# EAGLE design ERA_USB_PWR (EAGLE 6.6.0)
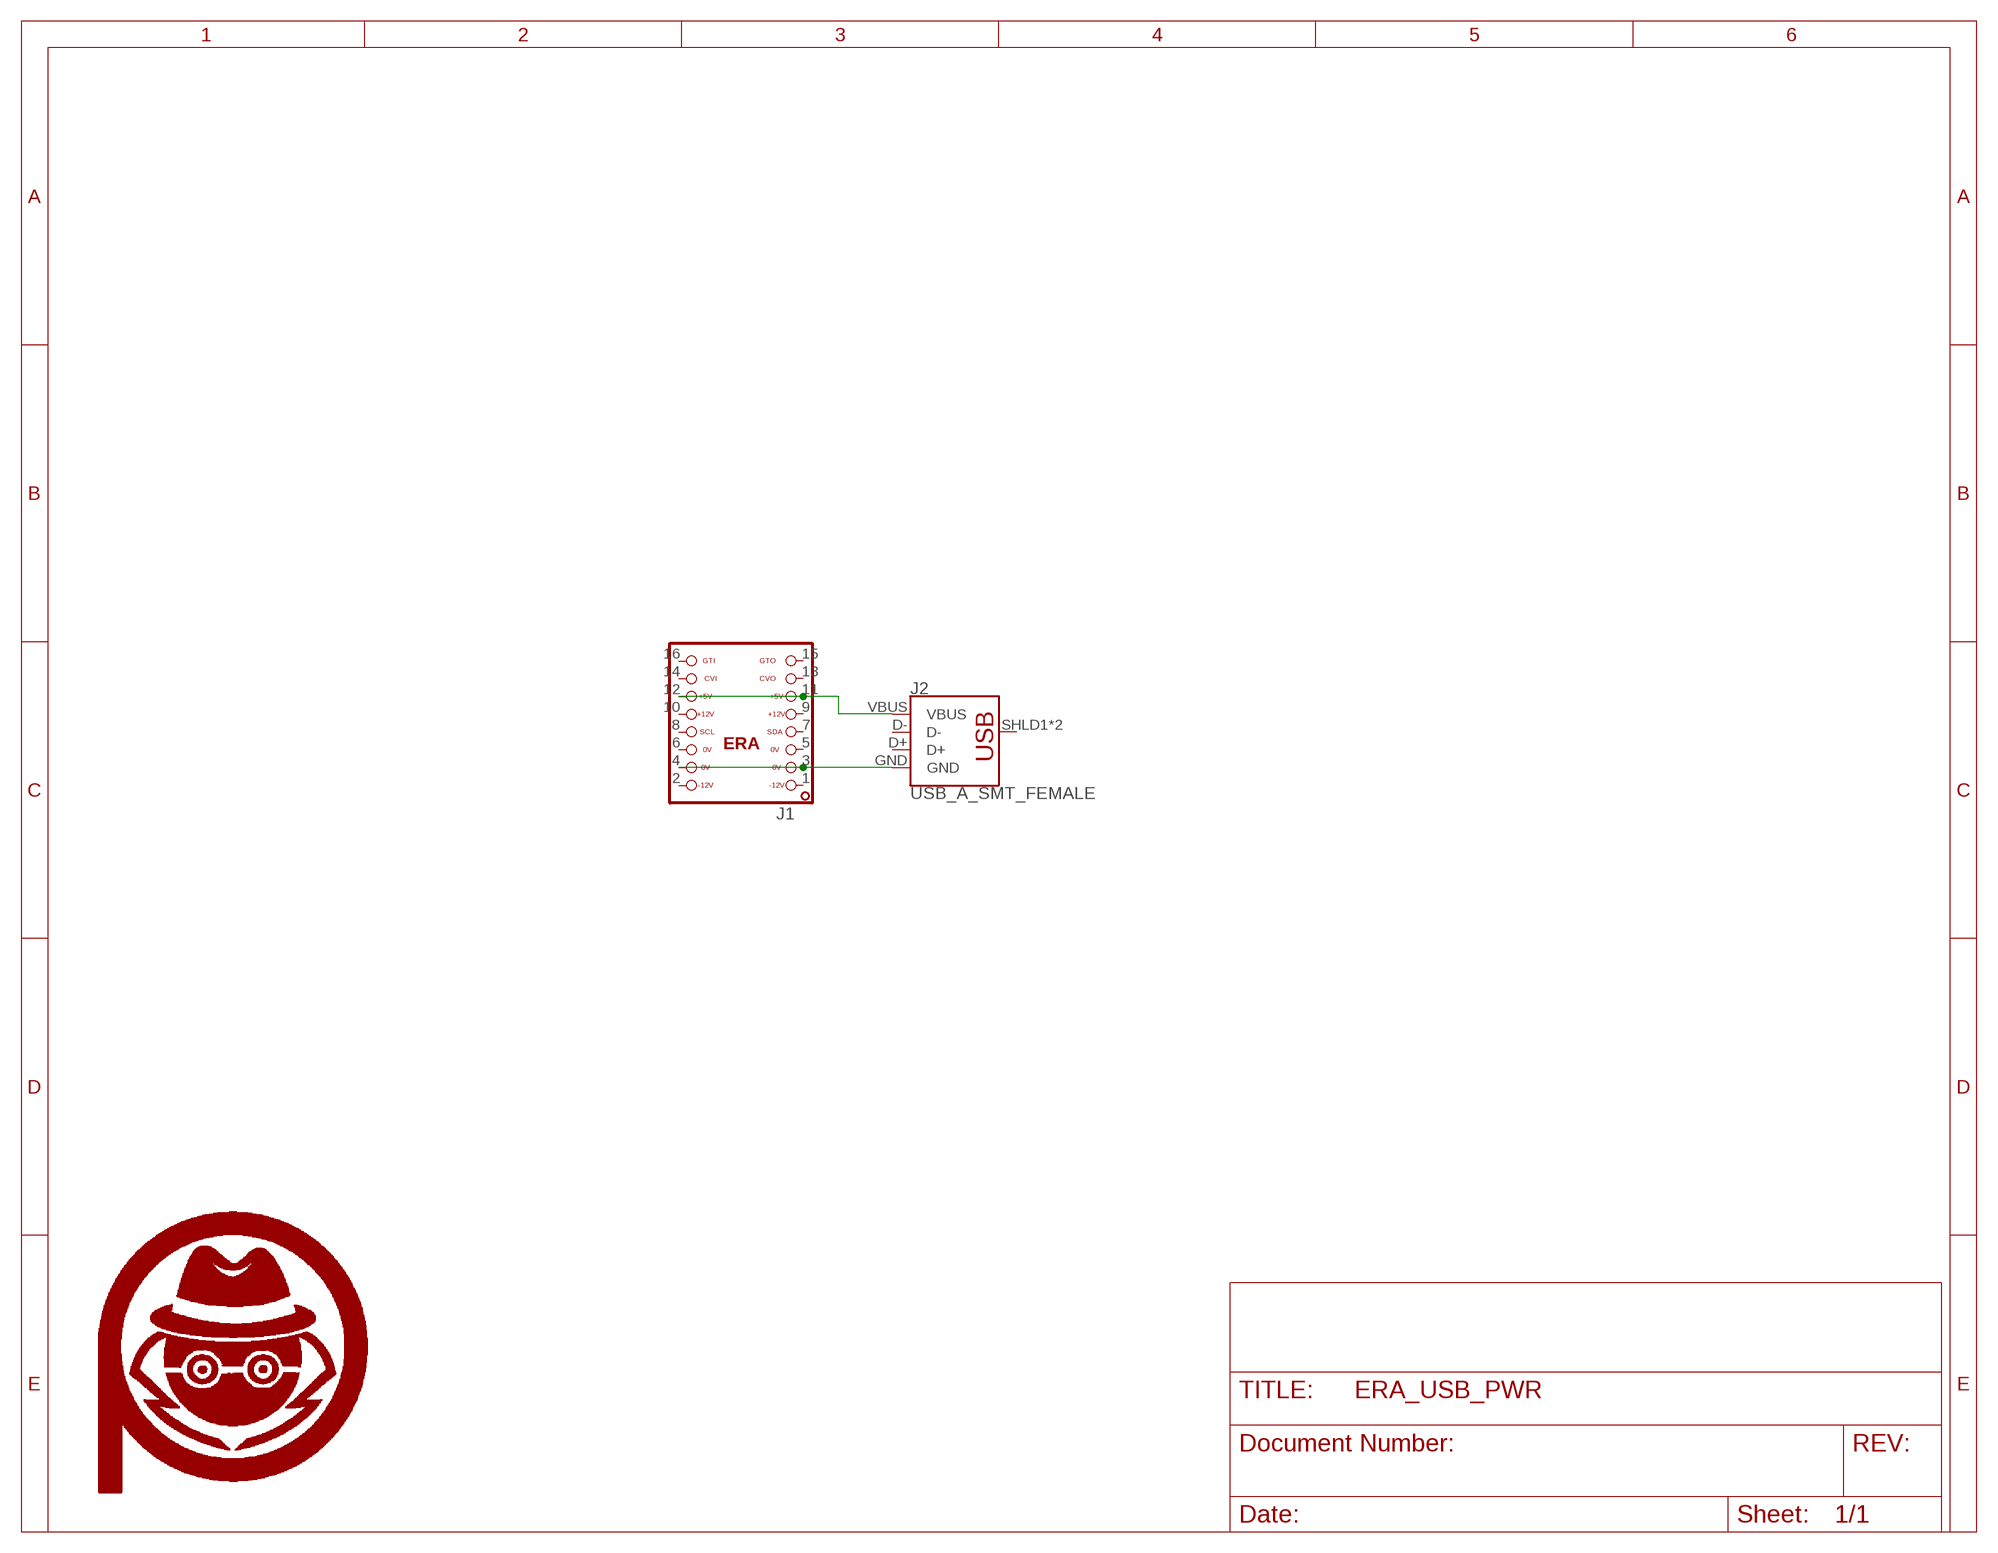
[diagram p0: schematic, sheet 1]

## Parts
J1  ERA_16PIN-NOSILK  [ERA-16-NOSILK]
J2  USB_A_SMT_FEMALE  [USB-A-S-SILK-FEMALE]
U$1  PA_LOGO_SYMSMALL  [PA_LOGO_AGENT_SMALL_SYM]
U$2  PA_LOGO_SYMSMALL  [PA_LOGO_AGENT_SMALL_SYM]

## Nets
GND: J1.3 J1.4 J2.GND
N$2: J1.11 J1.12 J2.VBUS
Unconnected: J1.1 J1.2 J1.5 J1.6 J1.7 J1.8 J1.9 J1.10 J1.13 J1.14 J1.15 J1.16 J2.D+ J2.D- J2.SHLD1(SHIELD) J2.SHLD2(SHIELD)

## Library data of the parts
J1 = ERA:ERA_16PIN: EuroRack2 - Backplane Connector
J2 = SparkFun-Connectors:USB_A: USB-A Connector Male and female variants, as well as PTH and SMT variants SparkFun Products: SparkFun XBee Explorer Dongle <https://www.sparkfun.com/products/11697> PTH Male SparkFun MicroView-USB Programmer <https://www.sparkfun.com/products/12924> SMT Male SparkFun USB Type A Female Breakout <https://www.sparkfun.com/products/12700> SMT Female; PROD_ID: CONN-09520; SF_ID: PRT-09011
U$1 U$2 = PatternAgents-Logos:PA_LOGO_SYM: PatternAgents Logo Symbol Trademark : PatternAgents, LLC Github : https://github.com/PatternAgents/PCB_Libraries License : http://creativecommons.org/licenses/by-sa/3.0/ (Creative Commons 3.0) THIS SOFTWARE IS PROVIDED BY THE CONTRIBUTORS "AS IS" AND WITHOUT ANY EXPRESS OR IMPLIED WARRANTIES, INCLUDING, BUT NOT LIMITED TO, THE IMPLIED WARRANTIES OF MERCHANTABILITY AND FITNESS FOR A PARTICULAR PURPOSE ARE DISCLAIMED. IN NO EVENT SHALL THE COPYRIGHT OWNER OR CONTRIBUTORS BE LIABLE FOR ANY DIRECT, INDIRECT, INCIDENTAL, SPECIAL, EXEMPLARY, OR CONSEQUENTIAL DAMAGES (INCLUDING, BUT NOT LIMITED TO, PROCUREMENT OF SUBSTITUTE GOODS OR SERVICES; LOSS OF USE, DATA, OR PROFITS; OR BUSINESS INTERRUPTION) HOWEVER CAUSED AND ON ANY THEORY OF LIABILITY, WHETHER IN CONTRACT, STRICT LIABILITY, OR TORT (INCLUDING NEGLIGENCE OR OTHERWISE) ARISING IN ANY WAY OUT OF THE USE OF THIS SOFTWARE, EVEN IF ADVISED OF THE POSSIBILITY OF SUCH DAMAGE.

## Board
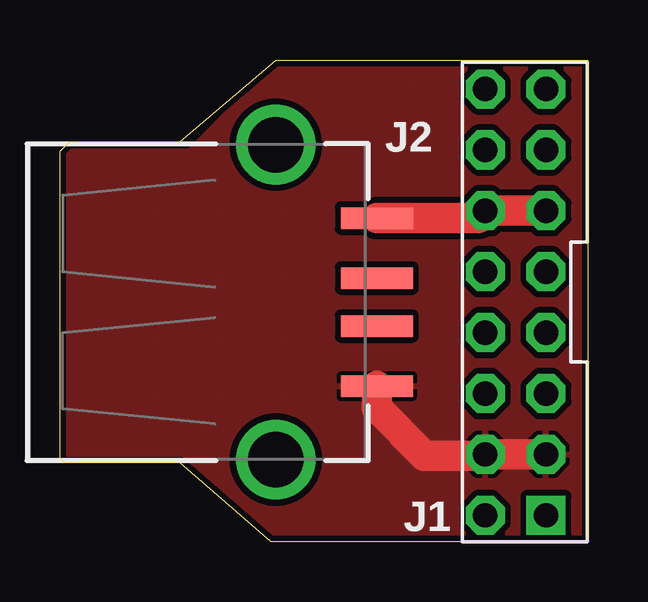
[diagram p1: board, top side]
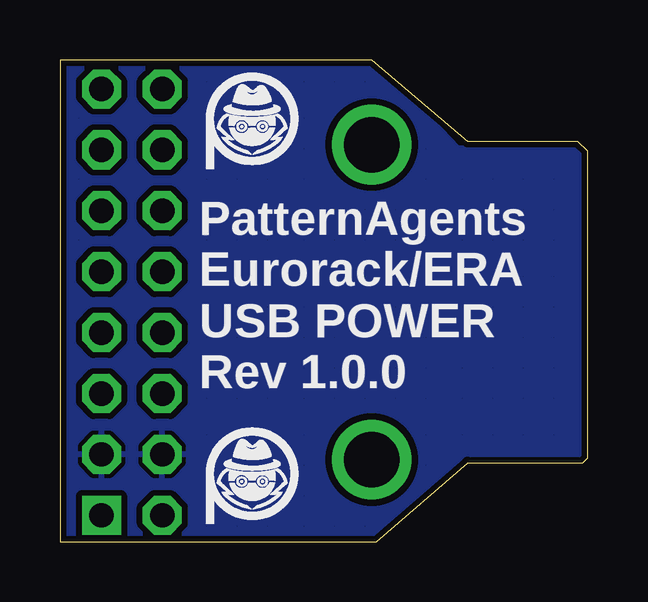
[diagram p2: board, bottom side, seen from below]

Size 22 x 20.1 mm. Coordinates in mm from the lower left corner, seen from the top.
Outline: 22,20.1 22,0 8.8,0 5,3.3 0.2,3.3 0,3.5 0,16.3 0.4,16.7 5,16.7 9,20.1 22,20.1
Copper layers (1*16): Top 0.035mm / dielectric 1.5mm / Bottom 0.035mm
Design rules "PatternAgents_7mil": minimum track width 7mil, minimum drill 14mil, track to track 7mil, track to pad 7mil, pad to pad 7mil, via to via 7mil, smd to smd 7mil, copper to edge 7mil, drill to drill 7mil, minimum pad ring 12mil, minimum via ring 10mil, stop-mask expansion 4mil, vias tented up to drill 25mil, thermal gap 7mil

### Footprints (pad centres in the part's own frame; a part is rotated, then mirrored left to right if it is on the bottom)
ERA-16-NOSILK = drill 1.016 square: 1 -8.89,-1.27 | drill 1.016 octagon: 2 -8.89,1.27; 3 -6.35,-1.27; 4 -6.35,1.27; 5 -3.81,-1.27; 6 -3.81,1.27; 7 -1.27,-1.27; 8 -1.27,1.27; 9 1.27,-1.27; 10 1.27,1.27; 11 3.81,-1.27; 12 3.81,1.27; 13 6.35,-1.27; 14 6.35,1.27; 15 8.89,-1.27; 16 8.89,1.27
USB-A-S-SILK-FEMALE = smd 3 x 0.9: D+ 7.212,-1; D- 7.212,1; GND 7.212,-3.5; VBUS 7.212,3.5 | drill 2.311: SHLD1 3,-6.566; SHLD2 3,6.566

### Placement (x,y rotation side)
J1  19,10 90 top
J2  6,10 0 top
U$1  14,17.3 0 bottom
U$2  14,2.5 0 bottom

### Tracks (layer width: path | path; a pad name or v marks a point on that pad's centre or on a via)
GND
  Top 1.27: J2.GND 13.21,5.59 15.2,3.6 17.68,3.6 J1.4 J1.3
  pour Top (isolate 0.254, hatched): 0,3.4 0,16.2 0.1,16.3 5.4,16.3 9.2,20.2 21.9,20.2 22,20 22,0.1 21.9,-0.1 8.8,-0.1 5.4,3.4
  pour Bottom (isolate 0.254, hatched): 0.1,3.7 0.2,16 0.6,16.4 5.4,16.4 9,20.2 21.8,20.2 22,20 22,0.1 21.9,-0.1 8.9,-0.1 8.8,0.1 8.5,0.1 5.2,3.4 0.6,3.3
N$2
  Top 1.27: J1.11 J1.12 17.42,13.5 J2.VBUS

### Text on the board
bPlace: PatternAgents / Eurorack/ERA / USB POWER / Rev 1.0.0